# EAGLE schematic zx81 SD_12 (EAGLE 9.6.2)
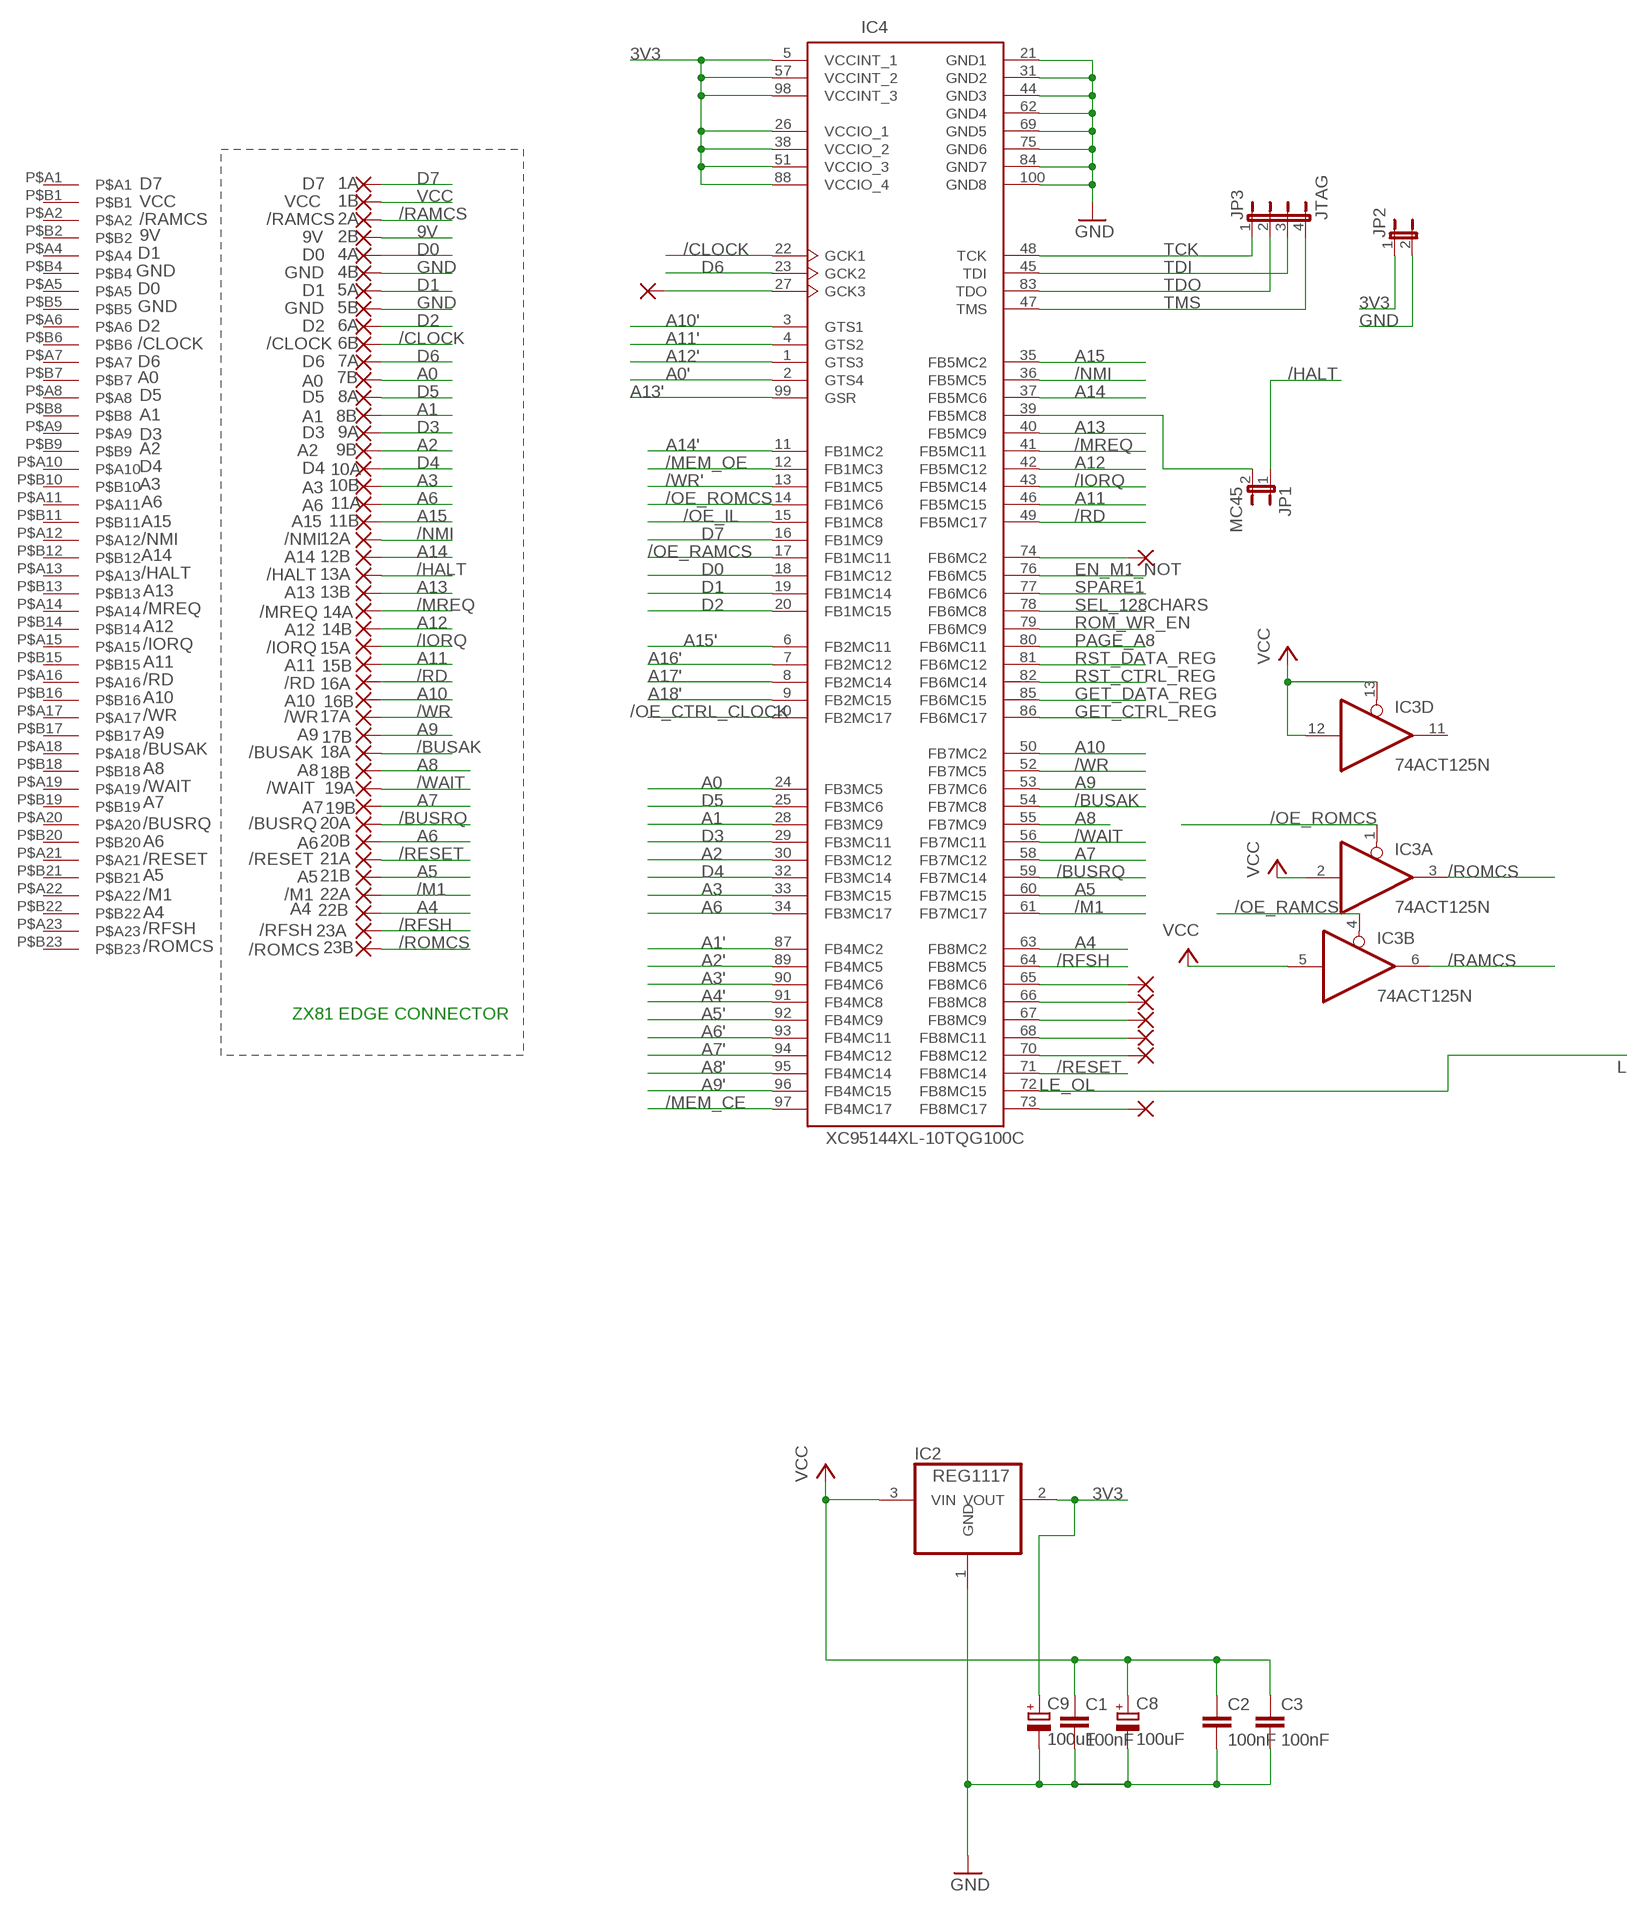
[diagram p0: schematic, sheet 1, part 1 of 2]
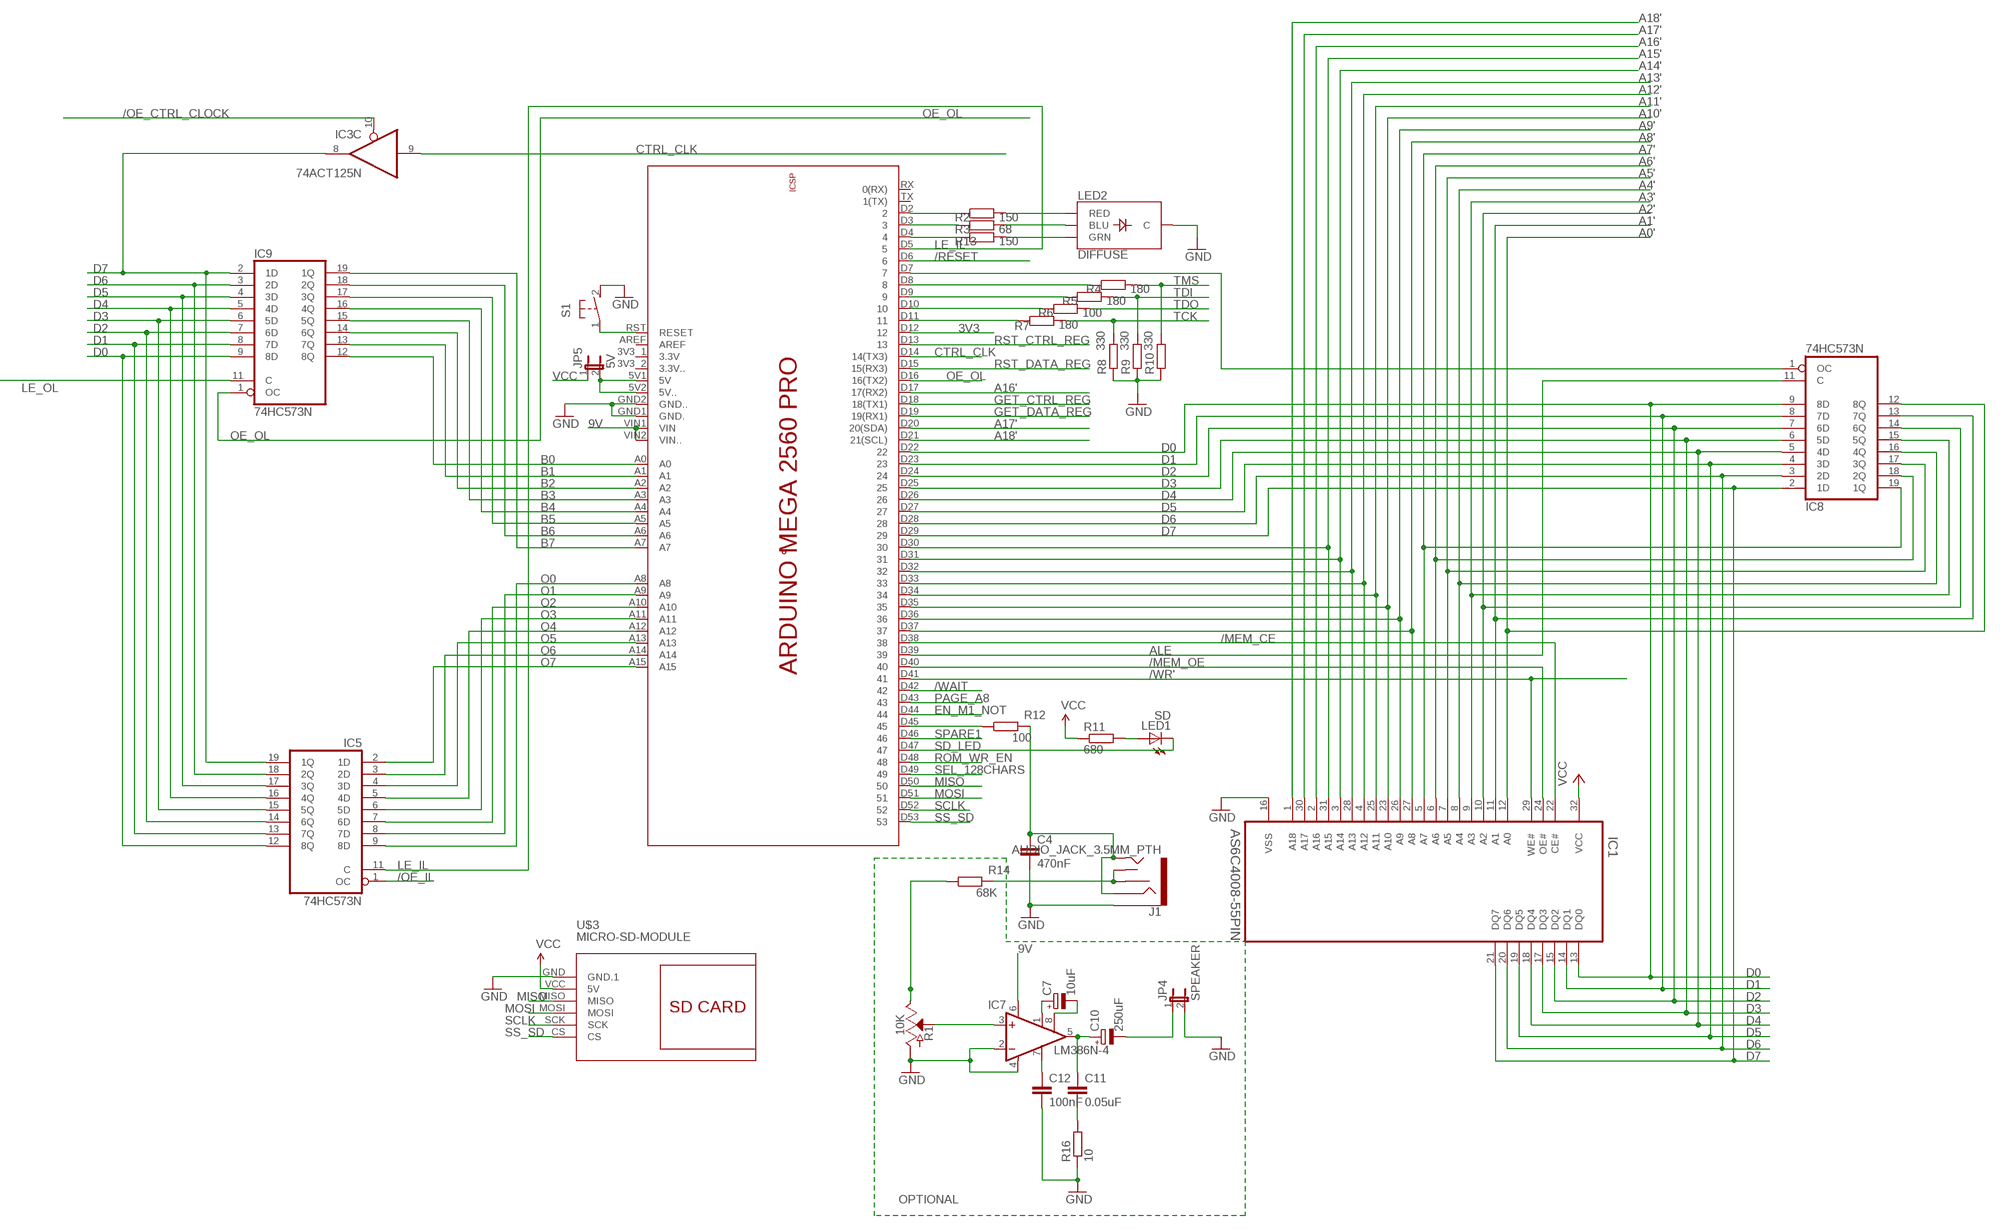
[diagram p1: schematic, sheet 1, part 2 of 2]

## Parts
1A  D7  SMD2EDGEPIN  [EDGEPIN]
1B  VCC  SMD2EDGEPIN  [EDGEPIN]
2A  /RAMCS  SMD2EDGEPIN  [EDGEPIN]
2B  9V  SMD2EDGEPIN  [EDGEPIN]
4A  D0  SMD2EDGEPIN  [EDGEPIN]
4B  GND  SMD2EDGEPIN  [EDGEPIN]
5A  D1  SMD2EDGEPIN  [EDGEPIN]
5B  GND  SMD2EDGEPIN  [EDGEPIN]
6A  D2  SMD2EDGEPIN  [EDGEPIN]
6B  /CLOCK  SMD2EDGEPIN  [EDGEPIN]
7A  D6  SMD2EDGEPIN  [EDGEPIN]
7B  A0  SMD2EDGEPIN  [EDGEPIN]
8A  D5  SMD2EDGEPIN  [EDGEPIN]
8B  A1  SMD2EDGEPIN  [EDGEPIN]
9A  D3  SMD2EDGEPIN  [EDGEPIN]
9B  A2  SMD2EDGEPIN  [EDGEPIN]
10A  D4  SMD2EDGEPIN  [EDGEPIN]
10B  A3  SMD2EDGEPIN  [EDGEPIN]
11A  A6  SMD2EDGEPIN  [EDGEPIN]
11B  A15  SMD2EDGEPIN  [EDGEPIN]
12A  /NMI  SMD2EDGEPIN  [EDGEPIN]
12B  A14  SMD2EDGEPIN  [EDGEPIN]
13A  /HALT  SMD2EDGEPIN  [EDGEPIN]
13B  A13  SMD2EDGEPIN  [EDGEPIN]
14A  /MREQ  SMD2EDGEPIN  [EDGEPIN]
14B  A12  SMD2EDGEPIN  [EDGEPIN]
15A  /IORQ  SMD2EDGEPIN  [EDGEPIN]
15B  A11  SMD2EDGEPIN  [EDGEPIN]
16A  /RD  SMD2EDGEPIN  [EDGEPIN]
16B  A10  SMD2EDGEPIN  [EDGEPIN]
17A  /WR  SMD2EDGEPIN  [EDGEPIN]
17B  A9  SMD2EDGEPIN  [EDGEPIN]
18A  /BUSAK  SMD2EDGEPIN  [EDGEPIN]
18B  A8  SMD2EDGEPIN  [EDGEPIN]
19A  /WAIT  SMD2EDGEPIN  [EDGEPIN]
19B  A7  SMD2EDGEPIN  [EDGEPIN]
20A  /BUSRQ  SMD2EDGEPIN  [EDGEPIN]
20B  A6  SMD2EDGEPIN  [EDGEPIN]
21A  /RESET  SMD2EDGEPIN  [EDGEPIN]
21B  A5  SMD2EDGEPIN  [EDGEPIN]
22A  /M1  SMD2EDGEPIN  [EDGEPIN]
22B  A4  SMD2EDGEPIN  [EDGEPIN]
23A  /RFSH  SMD2EDGEPIN  [EDGEPIN]
23B  /ROMCS  SMD2EDGEPIN  [EDGEPIN]
C1  100nF  C-EU025-040X050  [C025-040X050]
C2  100nF  C-EU025-040X050  [C025-040X050]
C3  100nF  C-EU025-040X050  [C025-040X050]
C4  470nF  C-EU025-040X050  [C025-040X050]
C7  10uF  CPOL-EUE2-5  [E2-5]
C8  100uF  CPOL-EUE2-5  [E2-5]
C9  100uF  CPOL-EUE2-5  [E2-5]
C10  250uF  CPOL-EUE2-5  [E2-5]
C11  0.05uF  C-EU025-040X050  [C025-040X050]
C12  100nF  C-EU025-040X050  [C025-040X050]
IC1  AS6C4008-55PIN  [DIP1524W45P254L4203H406Q32]
IC2  REG1117  [SOT223]
IC3  74ACT125N  [DIL14]
IC4  XC95144XL-10TQG100C  [TQFP100]
IC5  74HC573N  [DIL20]
IC7  LM386N-4  [DIL08]
IC8  74HC573N  [DIL20]
IC9  74HC573N  [DIL20]
J1  AUDIO_JACK_3.5MM_PTH  [AUDIO-JACK]
JP1  MC45  JP1E  [JP1]
JP2  JP1E  [JP1]
JP3  JTAG  JP4E  [JP4]
JP4  SPEAKER  JP1E  [JP1]
JP5  5V  JP1E  [JP1]
LED1  SD  LED5MM  [LED5MM]
LED2  DIFFUSE  LED-RGB-CCDIFFUSE  [LED-RGB-THRU]
PAD1  1,6/0,8  [1,6/0,8]
PAD2  1,6/0,8  [1,6/0,8]
PAD3  1,6/0,8  [1,6/0,8]
PAD4  1,6/0,8  [1,6/0,8]
PAD5  1,6/0,8  [1,6/0,8]
PAD6  1,6/0,8  [1,6/0,8]
PAD7  1,6/0,8  [1,6/0,8]
PAD8  1,6/0,8  [1,6/0,8]
R1  10K  POT  [POT-WHEEL]
R2  150  R-EU_0204/7  [0204/7]
R3  68  R-EU_0204/7  [0204/7]
R4  180  R-EU_0204/7  [0204/7]
R5  180  R-EU_0204/7  [0204/7]
R6  100  R-EU_0204/7  [0204/7]
R7  180  R-EU_0204/7  [0204/7]
R8  330  R-EU_0204/7  [0204/7]
R9  330  R-EU_0204/7  [0204/7]
R10  330  R-EU_0204/7  [0204/7]
R11  680  R-EU_0204/7  [0204/7]
R12  100  R-EU_0204/7  [0204/7]
R13  150  R-EU_0204/7  [0204/7]
R14  68K  R-EU_0204/7  [0204/7]
R16  10  R-EU_0204/7  [0204/7]
S1  31-XX  [B3F-31XX]
U$1  ZX81_EDGE  [ZX81_IFACE]
U$2  E14_ARDUINO_REVC_ARDUINO_MEGA2560_PRO  [E14_ARDUINO_REVC_ARDUINO_MEGA2560_PRO]
U$3  MICRO-SD-MODULE  [MICROSD-MODULE]

## Nets
3V3: C9.+ IC2.2(VOUT) IC4.5(VCCINT_1) IC4.26(VCCIO_1) IC4.38(VCCIO_2) IC4.51(VCCIO_3) IC4.57(VCCINT_2) IC4.88(VCCIO_4) IC4.98(VCCINT_3) JP2.1 U$2.D12
9V [VCC]: 2B.1(P) IC7.6(VS) U$2.VIN1(VIN) U$2.VIN2(VIN..)
/BUSAK: 18A.1(P) IC4.54(FB7MC8)
/BUSRQ: 20A.1(P) IC4.59(FB7MC14)
/CLOCK: 6B.1(P) IC4.22(GCK1)
/HALT: 13A.1(P) JP1.1
/IORQ: 15A.1(P) IC4.43(FB5MC14)
/M1: 22A.1(P) IC4.61(FB7MC17)
/MEM_CE: IC1.22(CE#) IC4.97(FB4MC17) U$2.D38
/MEM_OE: IC1.24(OE#) IC4.12(FB1MC3) U$2.D40
/MREQ: 14A.1(P) IC4.41(FB5MC11)
/NMI: 12A.1(P) IC4.36(FB5MC5)
/OE_CTRL_CLOCK: IC3.10(C:OE) IC4.10(FB2MC17)
/OE_IL: IC4.15(FB1MC8) IC5.1(OC)
/OE_RAMCS: IC3.4(B:OE) IC4.17(FB1MC11)
/OE_ROMCS: IC3.1(A:OE) IC4.14(FB1MC6)
/RAMCS: 2A.1(P) IC3.6(B:O)
/RD: 16A.1(P) IC4.49(FB5MC17)
/RESET: 21A.1(P) IC4.71(FB8MC14) U$2.D6
/RFSH: 23A.1(P) IC4.64(FB8MC5)
/ROMCS: 23B.1(P) IC3.3(A:O)
/WAIT: 19A.1(P) IC4.56(FB7MC11) U$2.D42
/WR: 17A.1(P) IC4.52(FB7MC5)
/WR': IC1.29(WE#) IC4.13(FB1MC5) U$2.D41
A0: 7B.1(P) IC4.24(FB3MC5)
A0': IC1.12(A0) IC4.2(GTS4) IC8.12(8Q)
A1: 8B.1(P) IC4.28(FB3MC9)
A1': IC1.11(A1) IC4.87(FB4MC2) IC8.13(7Q)
A2: 9B.1(P) IC4.30(FB3MC12)
A2': IC1.10(A2) IC4.89(FB4MC5) IC8.14(6Q)
A3: 10B.1(P) IC4.33(FB3MC15)
A3': IC1.9(A3) IC4.90(FB4MC6) IC8.15(5Q)
A4: 22B.1(P) IC4.63(FB8MC2)
A4': IC1.8(A4) IC4.91(FB4MC8) IC8.16(4Q)
A5: 21B.1(P) IC4.60(FB7MC15)
A5': IC1.7(A5) IC4.92(FB4MC9) IC8.17(3Q)
A6: 11A.1(P) 20B.1(P) IC4.34(FB3MC17)
A6': IC1.6(A6) IC4.93(FB4MC11) IC8.18(2Q)
A7: 19B.1(P) IC4.58(FB7MC12)
A7': IC1.5(A7) IC4.94(FB4MC12) IC8.19(1Q)
A8: 18B.1(P) IC4.55(FB7MC9)
A8': IC1.27(A8) IC4.95(FB4MC14) U$2.D37
A9: 17B.1(P) IC4.53(FB7MC6)
A9': IC1.26(A9) IC4.96(FB4MC15) U$2.D36
A10: 16B.1(P) IC4.50(FB7MC2)
A10': IC1.23(A10) IC4.3(GTS1) U$2.D35
A11: 15B.1(P) IC4.46(FB5MC15)
A11': IC1.25(A11) IC4.4(GTS2) U$2.D34
A12: 14B.1(P) IC4.42(FB5MC12)
A12': IC1.4(A12) IC4.1(GTS3) U$2.D33
A13: 13B.1(P) IC4.40(FB5MC9)
A13': IC1.28(A13) IC4.99(GSR) U$2.D32
A14: 12B.1(P) IC4.37(FB5MC6)
A14': IC1.3(A14) IC4.11(FB1MC2) U$2.D31
A15: 11B.1(P) IC4.35(FB5MC2)
A15': IC1.31(A15) IC4.6(FB2MC11) U$2.D30
A16': IC1.2(A16) IC4.7(FB2MC12) U$2.D17(17(RX2))
A17': IC1.30(A17) IC4.8(FB2MC14) U$2.D20(20(SDA))
A18': IC1.1(A18) IC4.9(FB2MC15) U$2.D21(21(SCL))
ALE: IC8.11(C) U$2.D39
B0: IC9.19(1Q) U$2.A7
B1: IC9.18(2Q) U$2.A6
B2: IC9.17(3Q) U$2.A5
B3: IC9.16(4Q) U$2.A4
B4: IC9.15(5Q) U$2.A3
B5: IC9.14(6Q) U$2.A2
B6: IC9.13(7Q) U$2.A1
B7: IC9.12(8Q) U$2.A0
CTRL_CLK: IC3.9(C:I) U$2.D14(14(TX3))
D0: 4A.1(P) IC1.13(DQ0) IC4.18(FB1MC12) IC5.12(8Q) IC8.9(8D) IC9.9(8D) U$2.D22
D1: 5A.1(P) IC1.14(DQ1) IC4.19(FB1MC14) IC5.13(7Q) IC8.8(7D) IC9.8(7D) U$2.D23
D2: 6A.1(P) IC1.15(DQ2) IC4.20(FB1MC15) IC5.14(6Q) IC8.7(6D) IC9.7(6D) U$2.D24
D3: 9A.1(P) IC1.17(DQ3) IC4.29(FB3MC11) IC5.15(5Q) IC8.6(5D) IC9.6(5D) U$2.D25
D4: 10A.1(P) IC1.18(DQ4) IC4.32(FB3MC14) IC5.16(4Q) IC8.5(4D) IC9.5(4D) U$2.D26
D5: 8A.1(P) IC1.19(DQ5) IC4.25(FB3MC6) IC5.17(3Q) IC8.4(3D) IC9.4(3D) U$2.D27
D6: 7A.1(P) IC1.20(DQ6) IC4.23(GCK2) IC5.18(2Q) IC8.3(2D) IC9.3(2D) U$2.D28
D7: 1A.1(P) IC1.21(DQ7) IC3.8(C:O) IC4.16(FB1MC9) IC5.19(1Q) IC8.2(1D) IC9.2(1D) U$2.D29
EN_M1_NOT: IC4.76(FB6MC5) U$2.D44
GET_CTRL_REG: IC4.86(FB6MC17) U$2.D18(18(TX1))
GET_DATA_REG: IC4.85(FB6MC15) U$2.D19(19(RX1))
GND [VCC]: 4B.1(P) 5B.1(P) C1.2 C2.2 C3.2 C4.2 C8.- C9.- C12.2 IC1.16(VSS) IC2.1(GND) IC4.21(GND1) IC4.31(GND2) IC4.44(GND3) IC4.62(GND4) IC4.69(GND5) IC4.75(GND6) IC4.84(GND7) IC4.100(GND8) IC7.2(-IN) IC7.4(GND) J1.SLEEVE JP2.2 JP4.2 LED2.2(C) R1.P$1(A) R8.1 R9.1 R10.1 R16.1 S1.2(S) U$2.GND1(GND.) U$2.GND2(GND..) U$3.GND(GND.1)
LE_IL: IC5.11(C) U$2.D5
LE_OL: IC4.72(FB8MC15) IC9.11(C)
MISO: U$2.D50 U$3.MISO
MOSI: U$2.D51 U$3.MOSI
N$1: IC8.1(OC) U$2.D7
N$2: IC4.74(FB6MC2) PAD8.1(P)
N$3: C10.- JP4.1
N$4: JP5.2 U$2.5V1(5V) U$2.5V2(5V..)
N$5: R4.1 U$2.D8
N$6: R1.P$2(E) R14.1
N$7: IC7.3(+IN) R1.P$3(S)
N$8: C4.1 J1.RING J1.TIP R12.2
N$9: R12.1 U$2.D45
N$10: C7.+ IC7.1(GAIN)
N$11: IC4.65(FB8MC6) PAD2.1(P)
N$12: R5.1 U$2.D9
N$13: R6.1 U$2.D10
N$14: R7.1 U$2.D11
N$15: LED1.A R11.2
N$16: IC4.66(FB8MC8) PAD3.1(P)
N$17: C7.- IC7.8(GAIN)
N$18: C10.+ C11.1 IC7.5(OUT)
N$19: IC4.67(FB8MC9) PAD4.1(P)
N$20: C12.1 IC7.7(BYPASS)
N$21: C11.2 R16.2
N$22: IC4.68(FB8MC11) PAD5.1(P)
N$23: IC4.73(FB8MC17) PAD6.1(P)
N$24: IC4.27(GCK3) PAD1.1(P)
N$25: IC4.70(FB8MC12) PAD7.1(P)
N$26: LED2.1(RED) R2.2
N$27: LED2.4(BLU) R3.2
N$28: LED2.3(GRN) R13.2
N$29: R2.1 U$2.D2
N$30: R3.1 U$2.D3
N$31: R13.1 U$2.D4
N$32: S1.1(P) U$2.RST(RESET)
N$33: IC4.39(FB5MC8) JP1.2
N$34: J1.RSH J1.TSH R14.2
O0: IC5.2(1D) U$2.A15
O1: IC5.3(2D) U$2.A14
O2: IC5.4(3D) U$2.A13
O3: IC5.5(4D) U$2.A12
O4: IC5.6(5D) U$2.A11
O5: IC5.7(6D) U$2.A10
O6: IC5.8(7D) U$2.A9
O7: IC5.9(8D) U$2.A8
OE_OL: IC9.1(OC) U$2.D16(16(TX2))
PAGE_A8: IC4.80(FB6MC11) U$2.D43
ROM_WR_EN: IC4.79(FB6MC9) U$2.D48
RST_CTRL_REG: IC4.82(FB6MC14) U$2.D13
RST_DATA_REG: IC4.81(FB6MC12) U$2.D15(15(RX3))
SCLK: U$2.D52 U$3.SCK
SD_LED: LED1.K(C) U$2.D47
SEL_128CHARS: IC4.78(FB6MC8) U$2.D49
SPARE1: IC4.77(FB6MC6) U$2.D46
SS_SD: U$2.D53 U$3.CS
TCK: IC4.48(TCK) JP3.1 R7.2 R8.2
TDI: IC4.45(TDI) JP3.3 R5.2 R9.2
TDO: IC4.83(TDO) JP3.2 R6.2
TMS: IC4.47(TMS) JP3.4 R4.2 R10.2
VCC [VCC]: 1B.1(P) C1.1 C2.1 C3.1 C8.+ IC1.32(VCC) IC2.3(VIN) IC3.2(A:I) IC3.5(B:I) IC3.12(D:I) IC3.13(D:OE) JP5.1 R11.1 U$3.VCC(5V)
Unconnected: IC3.11(D:O) U$1.P$A1 U$1.P$A2 U$1.P$A4 U$1.P$A5 U$1.P$A6 U$1.P$A7 U$1.P$A8 U$1.P$A9 U$1.P$A10 U$1.P$A11 U$1.P$A12 U$1.P$A13 U$1.P$A14 U$1.P$A15 U$1.P$A16 U$1.P$A17 U$1.P$A18 U$1.P$A19 U$1.P$A20 U$1.P$A21 U$1.P$A22 U$1.P$A23 U$1.P$B1 U$1.P$B2 U$1.P$B4 U$1.P$B5 U$1.P$B6 U$1.P$B7 U$1.P$B8 U$1.P$B9 U$1.P$B10 U$1.P$B11 U$1.P$B12 U$1.P$B13 U$1.P$B14 U$1.P$B15 U$1.P$B16 U$1.P$B17 U$1.P$B18 U$1.P$B19 U$1.P$B20 U$1.P$B21 U$1.P$B22 U$1.P$B23 U$2.3V3_1(3.3V) U$2.3V3_2(3.3V..) U$2.+5V_ U$2.AREF U$2.GND__ U$2.MISO U$2.MOSI U$2.RESET. U$2.RX(0(RX)) U$2.SCK U$2.TX(1(TX))

## Notes on the sheet
- ZX81 EDGE CONNECTOR
- OPTIONAL

## Power pins joined to a net without a drawn wire
GND: IC3.7(P:GND) IC5.10(GND) IC8.10(GND) IC9.10(GND)
VCC: IC3.14(P:VCC) IC5.20(VCC) IC8.20(VCC) IC9.20(VCC)

## Library data of the parts
1A 1B 2A 2B 4A 4B 5A 5B 6A 6B 7A 7B 8A 8B 9A 9B 10A 10B 11A 11B 12A 12B 13A 13B 14A 14B 15A 15B 16A 16B 17A 17B 18A 18B 19A 19B 20A 20B 21A 21B 22A 22B 23A 23B = wirepad:SMD2: SMD PAD
C1-C4 C11 C12 = rcl:C-EU: CAPACITOR, European symbol; SPICEPREFIX: C
C7-C10 = rcl:CPOL-EU: POLARIZED CAPACITOR, European symbol; SPICEPREFIX: C
IC1 = AS6C4008-55PIN:AS6C4008-55PIN: SRAM Chip Async Single 3.3V/5V 4M-Bit 512K x 8Bit 55ns 32-Pin PDIP Check availability <https://pricing.snapeda.com/parts/AS6C4008-55PIN/Alliance/view-part?ref=eda>; AVAILABILITY: In Stock; DESCRIPTION: SRAM - Asynchronous Memory IC 4Mb (512K x 8) Parallel 55 ns 32-PDIP; MF: Alliance; MP: AS6C4008-55PIN; PACKAGE: PDIP-32 Alliance Memory; PRICE: None; PURCHASE-URL: https://pricing.snapeda.com/search/part/AS6C4008-55PIN/?ref=eda
IC2 = burr-brown:REG1117: 800mA and 1A Low Dropout (LDO) Positive Regulator 1.8V, 2.5V, 2.85V, 3.3V, 5V, and Adj; MPN: REG1117; OC_FARNELL: 1097566; OC_NEWARK: 14P6981
IC3 = 74xx-eu:74*125: Quad bus BUFFER, 3-state
IC4 = XC95144XL-10TQG100C:XC95144XL-10TQG100C: Xilinx 9500XL series CPLD, 144 Macrocells, -10 speed grade. 100pin. Check availability <https://pricing.snapeda.com/parts/XC95144XL-10TQG100C/Xilinx%20Inc./view-part?ref=eda>; AVAILABILITY: In Stock; DESCRIPTION: IC CPLD 144MC 10NS 100TQFP; MF: Xilinx Inc.; MP: XC95144XL-10TQG100C; PACKAGE: TQFP-100 Xilinx; PRICE: None; PURCHASE-URL: https://pricing.snapeda.com/search/part/XC95144XL-10TQG100C/?ref=eda
IC5 IC8 IC9 = 74xx-eu:74*573: 8-bit D latch BUS DRIVER
IC7 = linear:LM386?-*: Low Voltage Audio Power Amplifier Source: http://cache.national.com/ds/LM/LM386.pdf
J1 = SparkFun-Connectors:AUDIO_JACK_3.5MM: Audio Jack 3.5mm variants of PTH and SMT stereo audio jack with bypass switches. SparkFun Products: SparkFun SparkPunk Sound Kit <[https://www.sparkfun.com/products/11177]> - PTH MP3 Trigger <https://www.sparkfun.com/products/13720> -3.5mm SMD SparkFun PicoBoard <https://www.sparkfun.com/products/11888>- 2.5mm SMD; PROD_ID: CONN-08774; SF_ID: PRT-08032
JP1 JP2 JP4 JP5 = jumper:JP1E: JUMPER
JP3 = jumper:JP4E: JUMPER
LED1 = adafruit:LED: LED OSRAM: - CHIPLED LG R971, LG N971, LY N971, LG Q971, LY Q971, LO R971, LY R971 LH N974, LH R974 LS Q976, LO Q976, LY Q976 LO Q996 - Hyper CHIPLED LW Q18S LB Q993, LB Q99A, LB R99A - SideLED LS A670, LO A670, LY A670, LG A670, LP A670 LB A673, LV A673, LT A673, LW A673 LH A674 LY A675 LS A676, LA A676, LO A676, LY A676, LW A676 LS A679, LY A679, LG A679 - Hyper Micro SIDELED® LS Y876, LA Y876, LO Y876, LY Y876 LT Y87S - SmartLED LW L88C, LW L88S LB L89C, LB L89S, LG L890 LS L89K, LO L89K, LY L89K LS L896, LA L896, LO L896, LY L896 - TOPLED LS T670, LO T670, LY T670, LG T670, LP T670 LSG T670, LSP T670, LSY T670, LOP T670, LYG T670 LG T671, LOG T671, LSG T671 LB T673, LV T673, LT T673, LW T673 LH T674 LS T676, LA T676, LO T676, LY T676, LB T676, LH T676, LSB T676, LW T676 LB T67C, LV T67C, LT T67C, LS T67K, LO T67K, LY T67K, LW E67C LS E67B, LA E67B, LO E67B, LY E67B, LB E67C, LV E67C, LT E67C LW T67C LS T679, LY T679, LG T679 LS T770, LO T770, LY T770, LG T770, LP T770 LB T773, LV T773, LT T773, LW T773 LH T774 LS E675, LA E675, LY E675, LS T675 LS T776, LA T776, LO T776, LY T776, LB T776 LHGB T686 LT T68C, LB T68C - Hyper Mini TOPLED® LB M676 - Mini TOPLED Santana® LG M470 LS M47K, LO M47K, LY M47K Source: http://www.osram.convergy.de/
LED2 = SparkFun-LEDV1:LED-RGB-CC: LED-RGB Common Cathode Packages: LED RGB-THRU LED_PIRANHA_5MM SparkFun Products: RGB Diffused Common Cathode- Diffuse <[https://www.sparkfun.com/products/9264]> RGB Diffused Common Cathode - Clear <[https://www.sparkfun.com/products/105]> LED-RGB 5mm Square (Piranha) <[https://www.sparkfun.com/products/11679]>; PROD_ID: DIO-09434
PAD1-PAD8 = wirepad:1,6/0,8: THROUGH-HOLE PAD
R1 = Pots:POT
R2-R10 R13 = rcl:R-EU_: RESISTOR, European symbol; SPICEPREFIX: R
R11 R12 R14 R16 = rcl:R-EU_: RESISTOR, European symbol
S1 = switch-omron:31-XX: OMRON SWITCH; MPN: B3F-3100; OC_FARNELL: 959704; OC_NEWARK: 36M3582
U$1 = EDGE:ZX81_EDGE
U$2 = E14_Arduino_revC:E14_ARDUINO_REVC_ARDUINO_MEGA2560_PRO
U$3 = diy-modules:MICRO-SD-MODULE

## Net classes
0 default: width 0.127 mm, drill 0.2 mm, clearance 0.127 mm
1 VCC: width 0.3 mm
2 3,3: width 0.4 mm, drill 0.5 mm, clearance 0.152 mm to class 0